# Altium project IRISkontroller.PrjPcb
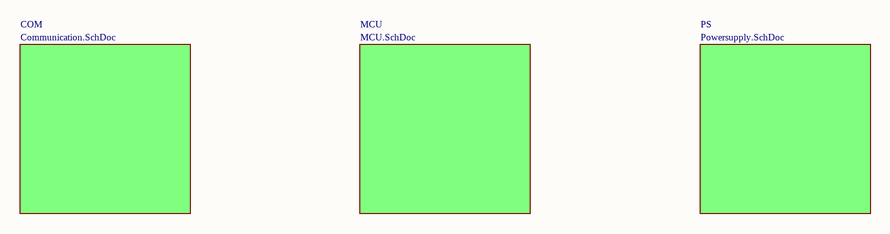
[diagram p0: Top.SchDoc]
4 sheets, 85 parts. Net scope: global (net labels, ports and power ports of the same name join across sheets).
Board file: IRISkontroller.PcbDoc
Sheets:
  Top.SchDoc
    MCU = MCU.SchDoc
    PS = Powersupply.SchDoc
    COM = Communication.SchDoc

## Sheet Top.SchDoc
size A3

### Sub-sheets
COM = Communication.SchDoc: no entries
MCU = MCU.SchDoc: no entries
PS = Powersupply.SchDoc: no entries

## Sheet MCU.SchDoc
size A3
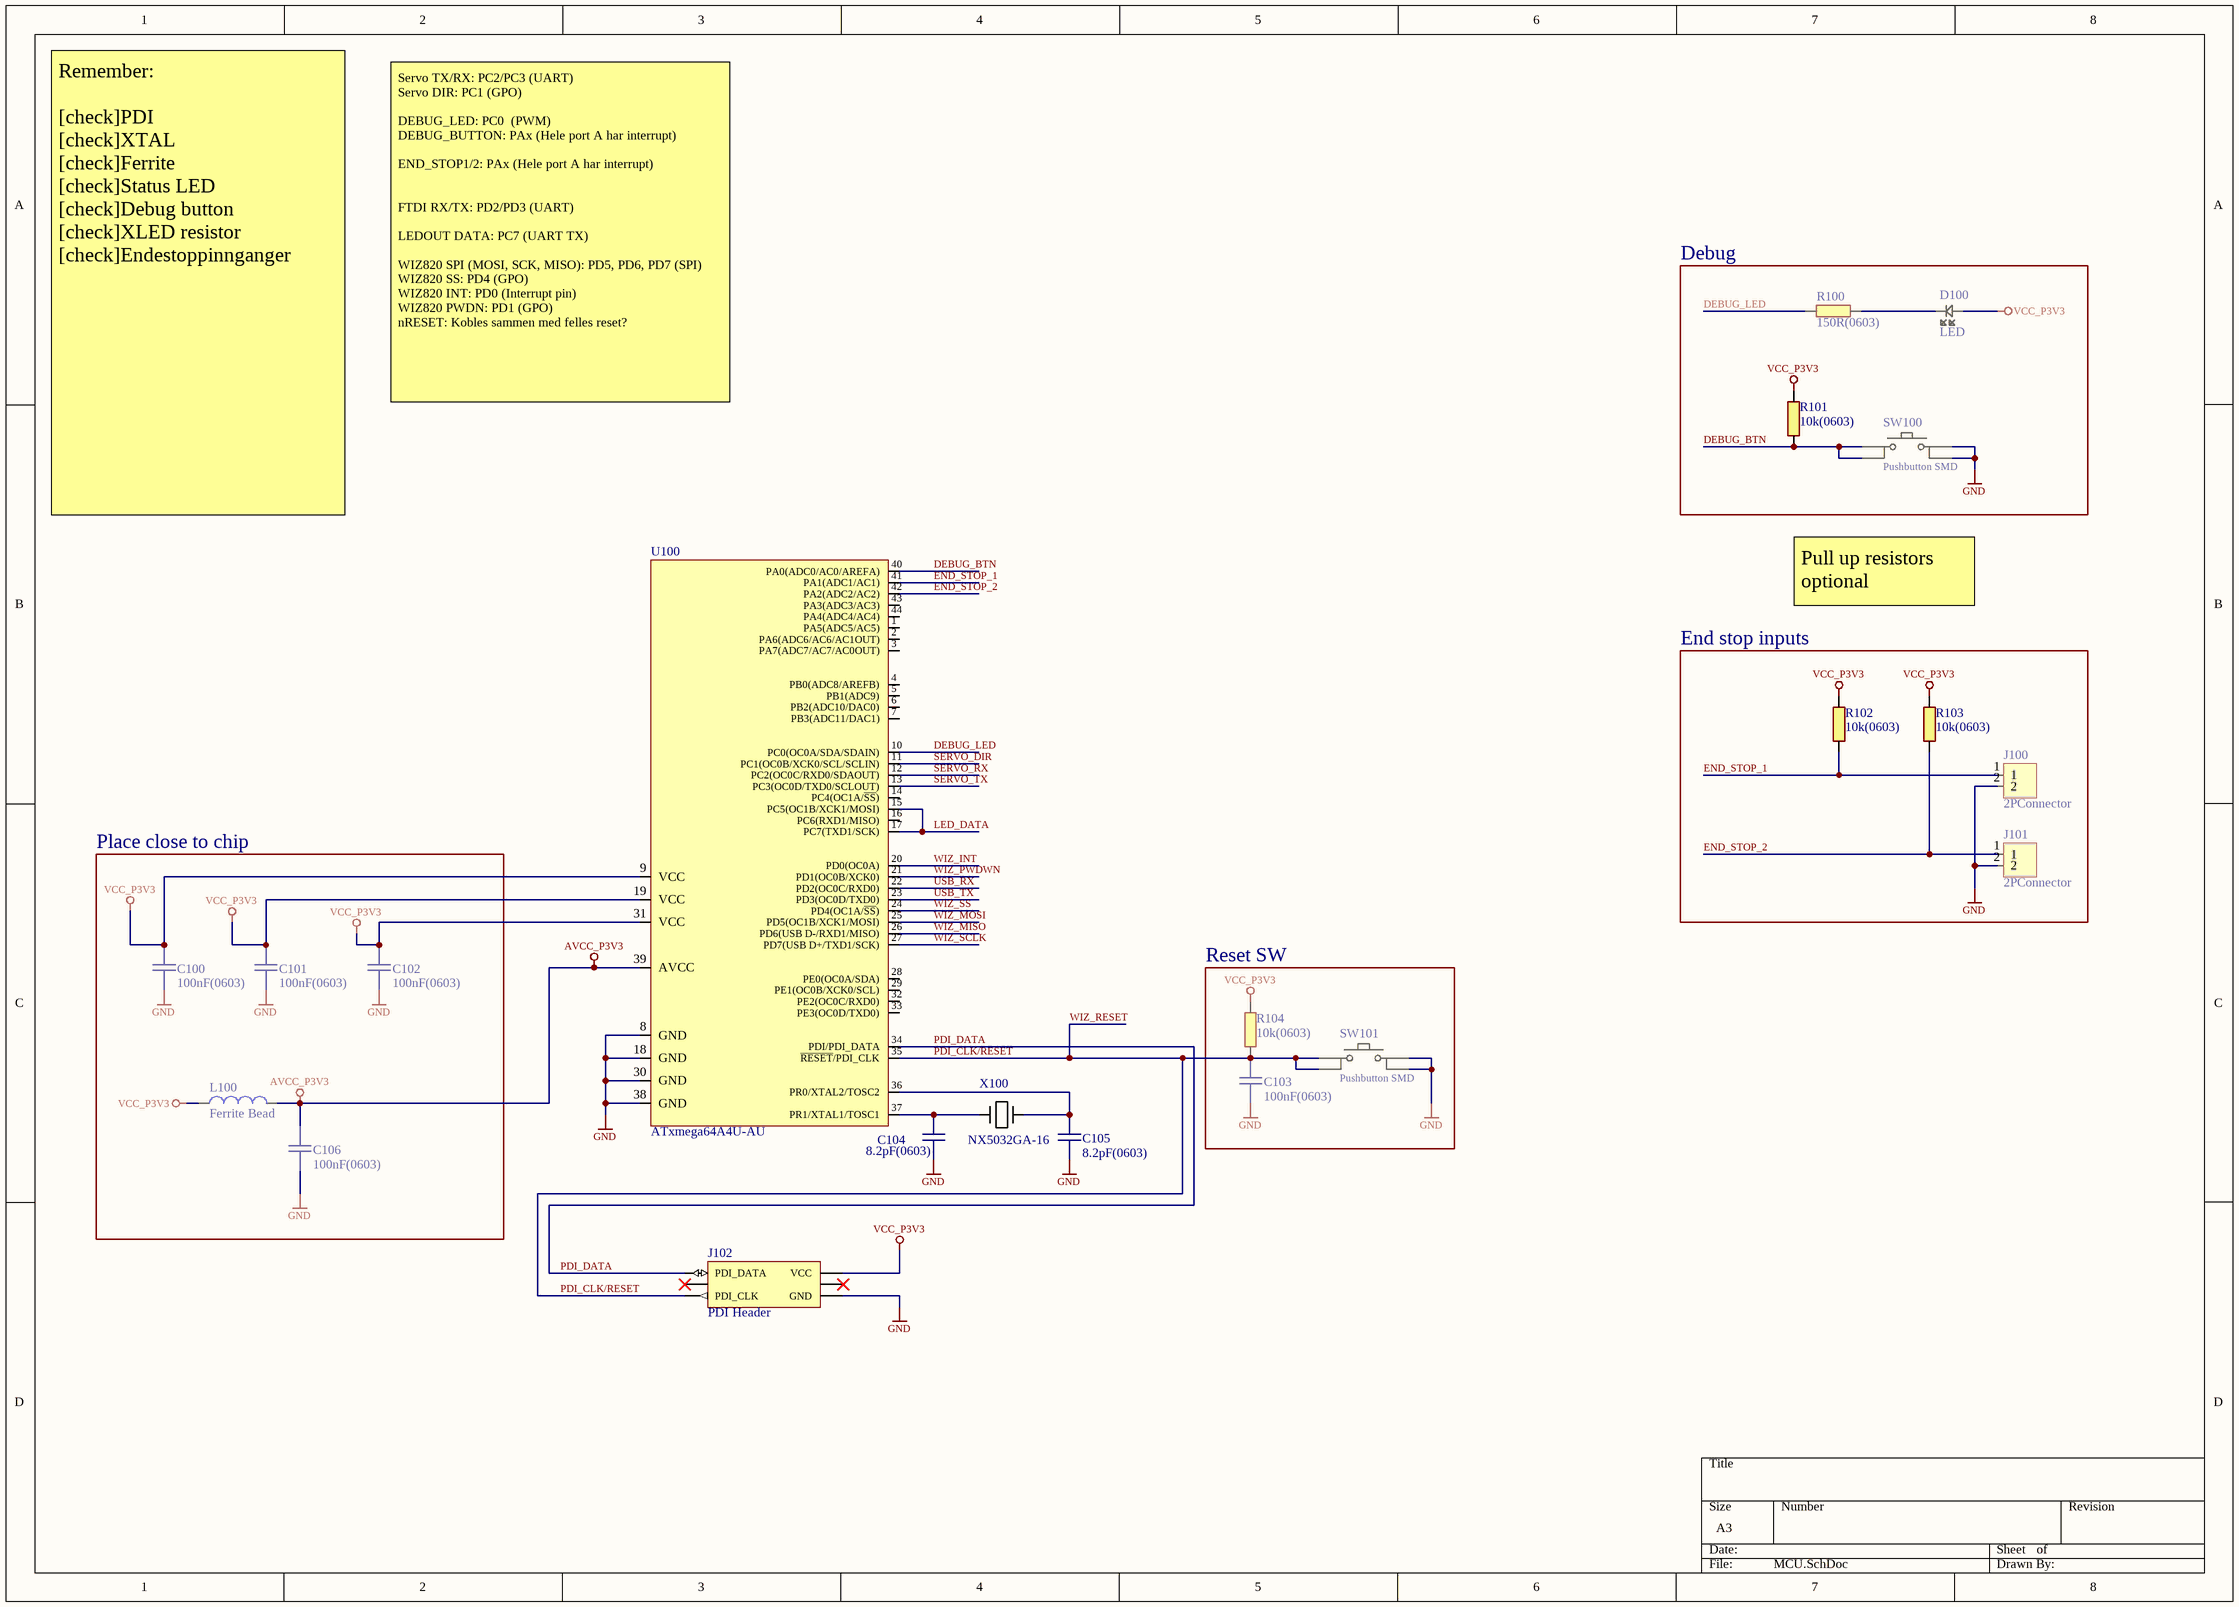
[diagram p1: MCU.SchDoc]

### Parts
C100  100nF(0603)  [CAPC0603(1608)55_N]
C101  100nF(0603)  [CAPC0603(1608)55_N]
C102  100nF(0603)  [CAPC0603(1608)55_N]
C103  100nF(0603)  [CAPC0603(1608)55_N]
C104  8.2pF(0603)  [CAPC0603(1608)55_N]
C105  8.2pF(0603)  [CAPC0603(1608)55_N]
C106  100nF(0603)  [CAPC0603(1608)55_N]
D100  LED  [I_LEDC0603(1608)_N]
J100  2PConnector  [JST_2P]
J101  2PConnector  [JST_2P]
J102  PDI Header  [HEADER_3x2]
L100  Ferrite Bead  [0603]
R100  150R(0603)  [RESC0603(1608)_N]
R101  10k(0603)  [RESC0603(1608)_N]
R102  10k(0603)  [RESC0603(1608)_N]
R103  10k(0603)  [RESC0603(1608)_N]
R104  10k(0603)  [RESC0603(1608)_N]
SW100  Pushbutton SMD  [SOIC254P500X160-4]
SW101  Pushbutton SMD  [SOIC254P500X160-4]
U100  ATxmega64A4U-AU  [44A_N]
X100  NX5032GA-16  [CRYSTAL-ABM7]

### Blocks framed on the sheet
Debug: D100 R100 R101 SW100
End stop inputs: J100 J101 R102 R103
Place close to chip: C100-C102 C106 L100
Reset SW: C103 R104 SW101

### Nets
AVCC_P3V3: C106.2 L100.2 U100.39(AVCC)
GND: C100.2 C101.2 C102.2 C103.1 C104.1 C105.1 C106.1 J100.2 J101.2 J102.6(GND) SW100.3 SW100.4 SW101.3 SW101.4 U100.8(GND) U100.18(GND) U100.30(GND) U100.38(GND)
VCC_P3V3: C100.1 C101.1 C102.1 D100.1 J102.2(VCC) L100.1 R101.2 R102.2 R103.2 R104.2 U100.9(VCC) U100.19(VCC) U100.31(VCC)
DEBUG_BTN: R101.1 SW100.1 SW100.2 U100.40(PA0(ADC0/AC0/AREFA))
DEBUG_LED: R100.1 U100.10(PC0(OC0A/SDA/SDAIN))
END_STOP_1: J100.1 R102.1 U100.41(PA1(ADC1/AC1))
END_STOP_2: J101.1 R103.1 U100.42(PA2(ADC2/AC2))
LED_DATA: U100.15(PC5(OC1B/XCK1/MOSI)) U100.17(PC7(TXD1/SCK))
PDI_CLK/RESET: C103.2 J102.5(PDI_CLK) R104.1 SW101.1 SW101.2 U100.35(~{RESET}/PDI_CLK)  [also labelled WIZ_RESET]
PDI_DATA: J102.1(PDI_DATA) U100.34(PDI/PDI_DATA)
SERVO_DIR: U100.11(PC1(OC0B/XCK0/SCL/SCLIN))
SERVO_RX: U100.12(PC2(OC0C/RXD0/SDAOUT))
SERVO_TX: U100.13(PC3(OC0D/TXD0/SCLOUT))
USB_RX: U100.22(PD2(OC0C/RXD0))
USB_TX: U100.23(PD3(OC0D/TXD0))
WIZ_INT: U100.20(PD0(OC0A))
WIZ_MISO: U100.26(PD6(USB_D-/RXD1/MISO))
WIZ_MOSI: U100.25(PD5(OC1B/XCK1/MOSI))
WIZ_PWDWN: U100.21(PD1(OC0B/XCK0))
WIZ_SCLK: U100.27(PD7(USB_D+/TXD1/SCK))
WIZ_SS: U100.24(PD4(OC1A/~{SS}))
NetC104_2: C104.2 U100.37(PR1/XTAL1/TOSC1) X100.1
NetC105_2: C105.2 U100.36(PR0/XTAL2/TOSC2) X100.2
NetD100_2: D100.2 R100.2

Not connected (* = marked no-connect by the designer): J102 3* 4*; U100 1(PA5(ADC5/AC5)) 2(PA6(ADC6/AC6/AC1OUT)) 3(PA7(ADC7/AC7/AC0OUT)) 4(PB0(ADC8/AREFB)) 5(PB1(ADC9)) 6(PB2(ADC10/DAC0)) 7(PB3(ADC11/DAC1)) 14(PC4(OC1A/~{SS})) 16(PC6(RXD1/MISO)) 28(PE0(OC0A/SDA)) 29(PE1(OC0B/XCK0/SCL)) 32(PE2(OC0C/RXD0)) 33(PE3(OC0D/TXD0)) 43(PA3(ADC3/AC3)) 44(PA4(ADC4/AC4))

### Notes on the sheet
- Servo TX/RX: PC2/PC3 (UART)
  Servo DIR: PC1 (GPO)
  DEBUG_LED: PC0 	(PWM)
  DEBUG_BUTTON: PAx (Hele port A har interrupt)
  END_STOP1/2: PAx (Hele port A har interrupt)
  FTDI RX/TX: PD2/PD3 (UART)
  LEDOUT DATA: PC7 (UART TX)
  WIZ820 SPI (MOSI, SCK, MISO): PD5, PD6, PD7 (SPI)
  WIZ820 SS: PD4 (GPO)
  WIZ820 INT: PD0 (Interrupt pin)
  WIZ820 PWDN: PD1 (GPO)
  nRESET: Kobles sammen med felles reset?
- Remember:
  [check]PDI
  [check]XTAL
  [check]Ferrite
  [check]Status LED
  [check]Debug button
  [check]XLED resistor
  [check]Endestoppinnganger
- Pull up resistors optional

### Library data of the parts
C100-C103 C106 = 100nF(0603): 100nF 0603 5% X7R 50V; pakke_opprettet_av: 815; pris: 1; nokkelord: Kondensator, Capacitor, CAP; pakketype: 93; id: 3028; navn: 100nF(0603); pakke_opprettet: 18.02.2015 14:18:13; symbol_opprettet_av: 815; symbol_opprettet: 14.11.2014 20:19:34
C104 C105 = 8.2pF(0603): 0603 5% NP0 50V; pakke_opprettet_av: 815; pris: 1; nokkelord: Kondensator, Capacitor, CAP; pakketype: 93; id: 3032; navn: 8.2pF(0603); pakke_opprettet: 18.02.2015 14:18:13; symbol_opprettet_av: 815; symbol_opprettet: 14.11.2014 20:19:34
D100 = SMD LED Red: SMD; rad: 0; rom: OV; lager_type: Fremlager; dybde: 2; hylle: 13; antall: 50; pakke_opprettet_av: 815; leverandor_varenr: 8554641; pris: 1; pakketype: 93; produsent: Avago; leverandor: Farnell; id: 2209; navn: SMD LED Red; kolonne: 0; pakke_opprettet: 06.07.2014 18:55:44; symbol_opprettet_av: 815; symbol_opprettet: 06.07.2014 18:59:47; nokkelord: SMD
J100 J101 = JST 2pin: pris pr. stk.; pakke_opprettet_av: 815; pris: 2; nokkelord: Connector, Kontakt; pakketype: 92; id: 2227; navn: JST 2pin; pakke_opprettet: 28.06.2014 18:25:03; symbol_opprettet_av: 815; symbol_opprettet: 28.06.2014 15:33:17
J102 = PDI-HEADER: PDI Xmega programming header; pakke_opprettet_av: 774; leverandor_varenr: Derp; pris: 3; pakketype: 92; produsent: OV; leverandor: Farnell; id: 2407; navn: PDI-HEADER; pakke_opprettet: 23.08.2014 13:37:50; symbol_opprettet_av: 774; symbol_opprettet: 23.08.2014 13:38:30; nokkelord: PDI Xmega programming
L100 = BLM18SG331TN1D: Ferrite Bead 0603; Farnell: 1515756RL; MPN: BLM18SG331TN1D; Digi-Key: 490-3997-1-ND
R100 = 3031: 0603 0.1W 1% Thick film resistor; id: 3031; pakke_opprettet_av: 815; symbol_opprettet_av: oystesm; pris: 0; nokkelord: Motstand, Resistor; pakketype: 93; produsent: Multikomp; pakke_opprettet: 08.07.2014 21:15:30; symbol_opprettet: 08.07.2014 21:16:33; navn: 150R(0603)
R101-R104 = 2444: 10k 0603 0.1W 1% Thick film resistor; id: 2444; rad: -1; rom: OV; lager_type: Fremlager; dybde: 72; hylle: 6; antall: 100; kolonne: 0; pakke_opprettet_av: 815; symbol_opprettet_av: oystesm; nokkelord: Resistor Motstand; pakketype: 93; pakke_opprettet: 08.07.2014 21:15:30; symbol_opprettet: 08.07.2014 21:16:33; navn: 10k(0603); pris: 0
SW100 SW101 = Pushbutton SMD: Momentary tactile pushbutton SMD; rad: 3; rom: OV; lager_type: Fremlager; dybde: 2; hylle: 7; antall: 100; pakke_opprettet_av: 815; nokkelord: smd, tactile, pushbutton, knapp, smd; pakketype: 101; id: 2413; navn: Pushbutton SMD; kolonne: 3; pakke_opprettet: 14.11.2014 22:12:31; symbol_opprettet_av: 815; symbol_opprettet: 14.11.2014 21:57:30; pris: 2
U100 = ATxmega64A4U-AU: 8/16-bit AVR XMEGA A4U Microcontroller, 1.6-3.6V, 64KB + 4KB Flash; PackageReference: 44A; PackageDescription: 44-Pin Plastic Thin Profile Quad Flat Pack, 10 x 10 x 1.0 mm Body, 0.8 mm Pitch (TQFP)
X100 = NX5032GA-16: Crystal 16 MHz; rad: 0; rom: OV; lager_type: Fremlager; dybde: 1; hylle: 2; antall: 42; kolonne: 3; pakke_opprettet_av: 774; leverandor_varenr: 644-1135-1-ND; pris: 5; nokkelord: xtal, oscillator; pakketype: 101; produsent: NDK; leverandor: DigiKey; id: 1594; navn: NX5032GA-16; pakke_opprettet: 23.08.2014 20:10:40; symbol_opprettet_av: 774; symbol_opprettet: 23.08.2014 20:23:20

## Sheet Powersupply.SchDoc
size A3
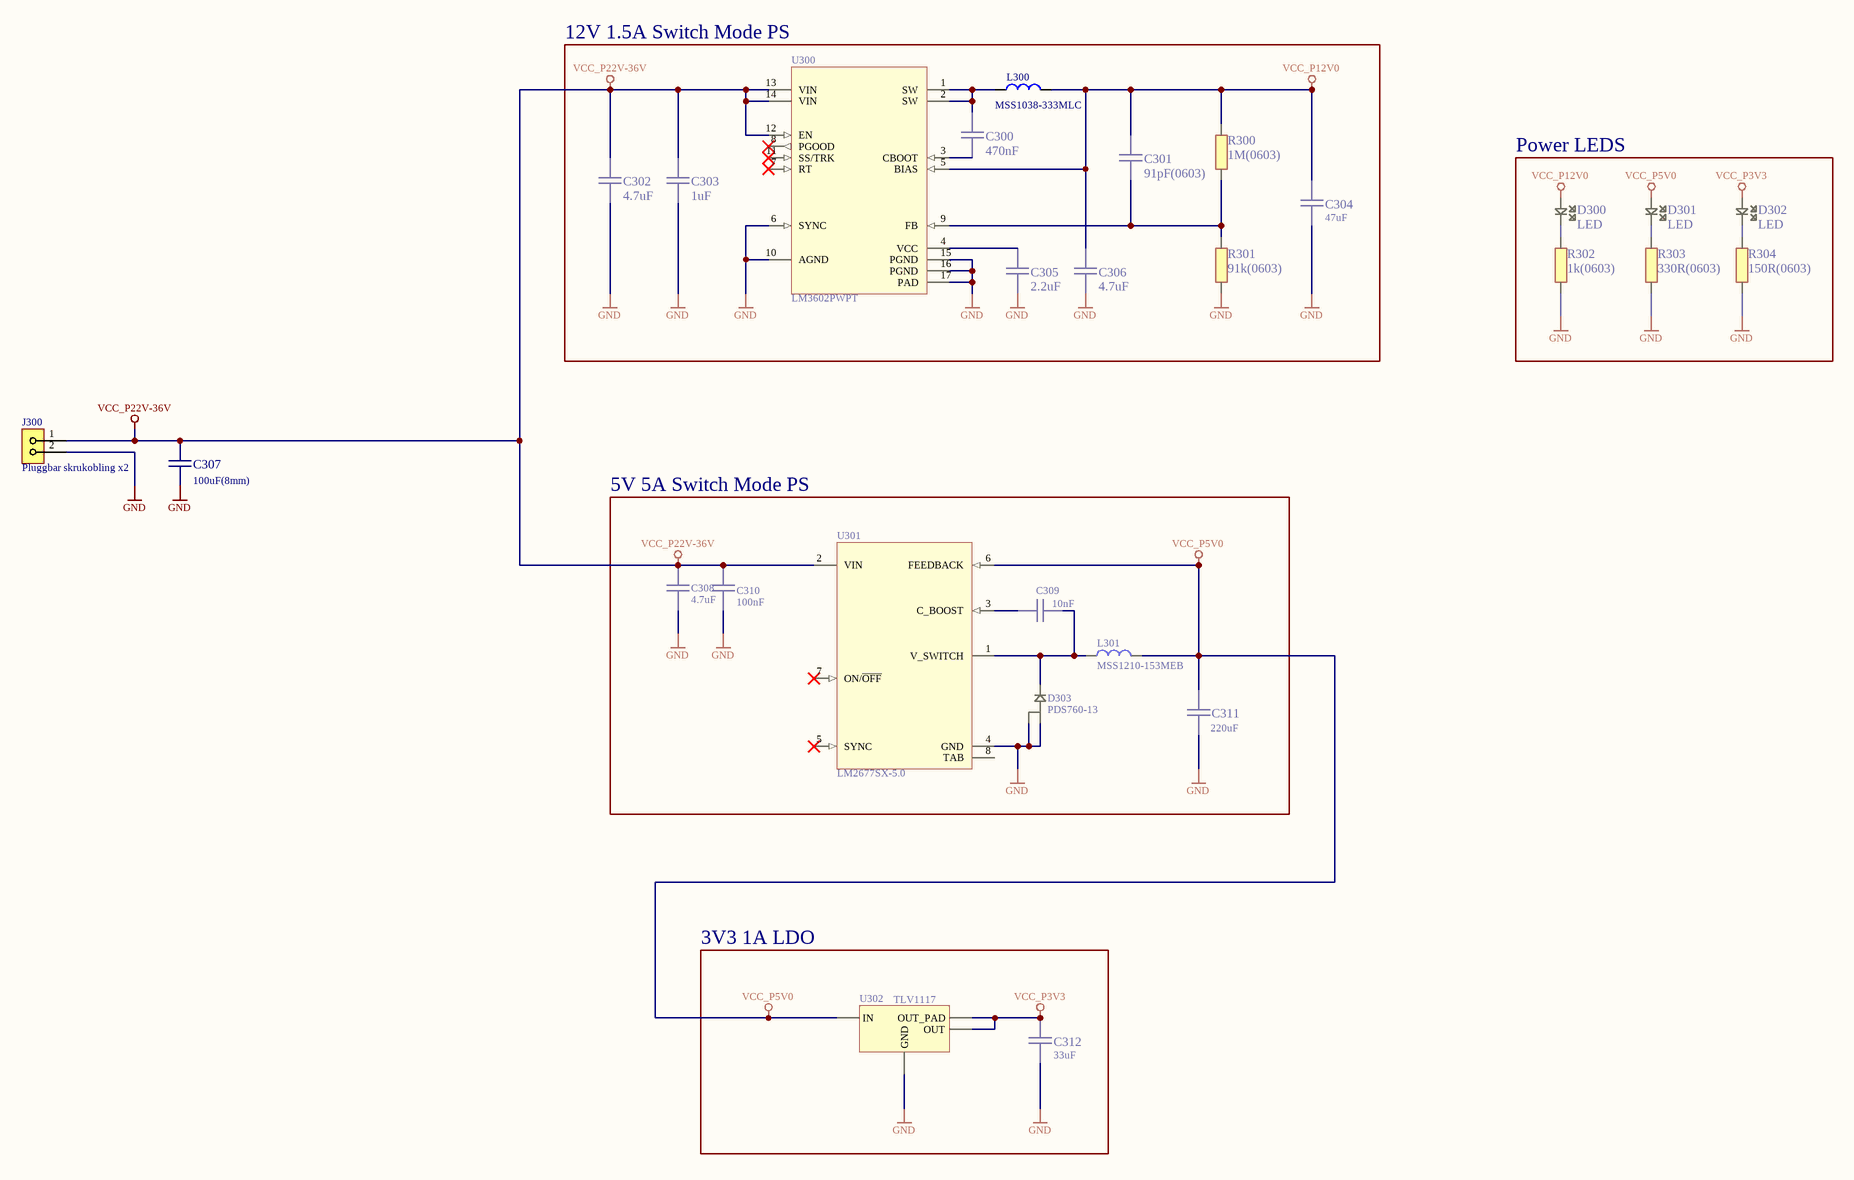
[diagram p2: Powersupply.SchDoc]

### Parts
C300  470nF  [CAPC0805(2012)100_N]
C301  91pF(0603)  [CAPC0603(1608)55_N]
C302  4.7uF  [CAPC1206(3216)170_N]
C303  1uF  [CAPC1206(3216)170_N]
C304  verdi: 47uF  [CAPMP7342X30N]  (hidden comment: T495D476M025ATE120)
C305  2.2uF  [CAPC0603(1608)55_N]
C306  4.7uF  [CAPC1206(3216)170_N]
C307  100uF(8mm)  [CAPPR35D08H11]
C308  4.7uF  [CAPC1206(3216)170_N]
C309  10nF  [CAPC0805(2012)100_N]
C310  100nF  [CAPC0805(2012)100_N]
C311  verdi: 220uF  [CAPMP7342X30N]  (hidden comment: 10TPB220ML)
C312  verdi: 33uF  [CAPMP7342X30N]  (hidden comment: 10TPB33M)
D300  LED  [I_LEDC0603(1608)_N]
D301  LED  [I_LEDC0603(1608)_N]
D302  LED  [I_LEDC0603(1608)_N]
D303  PDS760-13  [DFN540P650X115-3N]
J300  Pluggbar skrukobling x2  [FCI-20020110-C021A01LF]
L300  MSS1038-333MLC  [INDP102100X40N]
L301  MSS1210-153MEB  [INDP123123X100N]
R300  1M(0603)  [RESC0603(1608)_N]
R301  91k(0603)  [RESC0603(1608)_N]
R302  1k(0603)  [RESC0603(1608)_N]
R303  330R(0603)  [RESC0603(1608)_N]
R304  150R(0603)  [RESC0603(1608)_N]
U300  LM3602PWPT  [HTSSOP65P640X120_HS-17N]
U301  LM2677SX-5.0  [DPAK127P1336X457-8N]
U302  TLV1117  [SOT230P700X180-4N]

### Blocks framed on the sheet
12V 1.5A Switch Mode PS: C300-C306 L300 R300 R301 U300
Power LEDS: D300-D302 R302-R304
5V 5A Switch Mode PS: C308-C311 D303 L301 U301
3V3 1A LDO: C312 U302

### Nets
GND: C302.1 C303.1 C304.1 C305.1 C306.1 C307.1 C308.1 C310.1 C311.1 C312.1 D303.1(A) D303.2(A) J300.2 R301.1 R302.1 R303.1 R304.1 U300.6(SYNC) U300.10(AGND) U300.15(PGND) U300.16(PGND) U300.17(PAD) U301.4(GND) U302.1(GND)
VCC_P3V3: C312.2 D302.1 U302.2(OUT_PAD) U302.4(OUT)
VCC_P5V0: C311.2 D301.1 L301.2 U301.6(FEEDBACK) U302.3(IN)
VCC_P12V0: C301.2 C304.2 C306.2 D300.1 L300.2 R300.2 U300.5(BIAS)
VCC_P22V-36V: C302.2 C303.2 C307.2 C308.2 C310.2 J300.1 U300.12(EN) U300.13(VIN) U300.14(VIN) U301.2(VIN)
NetC300_1: C300.1 U300.3(CBOOT)
NetC300_2: C300.2 L300.1 U300.1(SW) U300.2(SW)
NetC301_1: C301.1 R300.1 R301.2 U300.9(FB)
NetC305_2: C305.2 U300.4(VCC)
NetC309_1: C309.1 U301.3(C_BOOST)
NetC309_2: C309.2 D303.3(K) L301.1 U301.1(V_SWITCH)
NetD300_2: D300.2 R302.2
NetD301_2: D301.2 R303.2
NetD302_2: D302.2 R304.2

Not connected (* = marked no-connect by the designer): U300 7(RT)* 8(PGOOD)* 11(SS/TRK)*; U301 5(SYNC)* 7(ON/~{OFF})* 8(TAB)

### Library data of the parts
C300 = 470nF: 470nF 0805 chip X7R 50V; pakke_opprettet_av: 815; leverandor_varenr: 2320847; pris: 1; nokkelord: Kondensator, capacitor; pakketype: 94; produsent: Multikomp; leverandor: Farnell; navn: 470nF; pakke_opprettet: 14.11.2014 20:52:01; symbol_opprettet_av: 815; symbol_opprettet: 14.11.2014 20:19:34
C301 = 91pF(0603): 100nF 0603 5% NP0 50V; pakke_opprettet_av: 815; leverandor_varenr: 1865484; pris: 1; nokkelord: Kondensator, Capacitor, CAP; pakketype: 93; produsent: Kemet; leverandor: Farnell; id: 3026; navn: 91pF(0603); pakke_opprettet: 18.02.2015 14:18:13; symbol_opprettet_av: 815; symbol_opprettet: 14.11.2014 20:19:34
C302 C306 C308 = 4.7uF: 100nF 1206 chip X7R 50V; pakke_opprettet_av: 815; pris: 1; nokkelord: Kondensator, capacitor; pakketype: 95; produsent: Multikomp; navn: 4.7uF; pakke_opprettet: 11.02.2015 13:21:22; symbol_opprettet_av: 815; symbol_opprettet: 14.11.2014 20:19:34
C303 = 1uF: 1uF 1206 chip X7R 50V; pakke_opprettet_av: 815; leverandor_varenr: 1759454; pris: 2; nokkelord: Kondensator, capacitor; pakketype: 95; produsent: Multikomp; leverandor: Farnell; navn: 1uF; pakke_opprettet: 11.02.2015 13:21:22; symbol_opprettet_av: 815; symbol_opprettet: 14.11.2014 20:19:34
C304 = T495D476M025ATE120: Manufacturer: Kemet; Farnell: 2395821; MPN: T495D476M025ATE120
C305 = 2.2uF: 2.2uF 0603 chip X7R 6.3V; pakke_opprettet_av: 815; leverandor_varenr: 2320810; pris: 1; nokkelord: Kondensator, capacitor; pakketype: 93; produsent: Multikomp; leverandor: Farnell; navn: 2.2uF; pakke_opprettet: 18.02.2015 14:18:13; symbol_opprettet_av: 815; symbol_opprettet: 14.11.2014 20:19:34
C307 = 100uF(8mm): D=8mm Radial, 20% 50V 3,5mm pitch; pakke_opprettet_av: 815; leverandor_varenr: 1902932; pris: 2; nokkelord: Kondensator, Capacitor, CAP; pakketype: 92; produsent: Multikomp; leverandor: Farnell; id: 3027; navn: 100uF(8mm); pakke_opprettet: 25.02.2015 11:22:52; symbol_opprettet_av: 815; symbol_opprettet: 14.11.2014 20:19:34
C309 = 10nF: 100nF 0805 chip X7R 50V; pakke_opprettet_av: 815; pris: 1; nokkelord: Kondensator, capacitor; pakketype: 94; produsent: Multikomp; navn: 10nF; pakke_opprettet: 14.11.2014 20:52:01; symbol_opprettet_av: 815; symbol_opprettet: 14.11.2014 20:19:34
C310 = 100nF: 100nF 0805 chip X7R 50V; pakke_opprettet_av: 815; leverandor_varenr: 2408556; pris: 1; nokkelord: Kondensator, capacitor; pakketype: 94; produsent: Multikomp; leverandor: Farnell; navn: 100nF; pakke_opprettet: 14.11.2014 20:52:01; symbol_opprettet_av: 815; symbol_opprettet: 14.11.2014 20:19:34
C311 = 10TPB220ML: Varenummer: 2354821; Leverandør: Farnell
C312 = 10TPB33M: Varenummer: 2354816; Leverandør: Farnell
D300-D302 = SMD LED Red: as D100 on sheet MCU; navn: SMD LED Red; kolonne: 0; pakke_opprettet: 06.07.2014 18:55:44; symbol_opprettet_av: 815; symbol_opprettet: 06.07.2014 18:59:47; nokkelord: SMD
D303 = PDS760-13: SCHOTTKY RECTIFIER POWERDI5; Leverandør: Farnell; Varenummer: 1713915
J300 = Pluggbar skrukobling x2: Skruplint; pakke_opprettet_av: 815; leverandor_varenr: 1787816; pris: 3; pakketype: 92; produsent: FCI; leverandor: Farnell; id: 2218; navn: Pluggbar skrukobling x2; pakke_opprettet: 13.11.2014 14:07:06; symbol_opprettet_av: 815; symbol_opprettet: 13.11.2014 10:58:53
L300 = MSS1038-333MLC: INDUCTOR, PWR, 33UH, 2.3A, 20%,13MHZ; Farnell: 2288211; MPN: MSS1038-333MLC
L301 = MSS1210-153MEB: INDUCTOR, PWR, 15UH, 8.7A, 20%,12MHZ; Farnell: 2288331
R300 = 3025: 0603 0.1W 1% Thick film resistor; id: 3025; rad: -1; rom: OV; lager_type: Fremlager; dybde: 119; hylle: 6; antall: 100; kolonne: 0; pakke_opprettet_av: 815; symbol_opprettet_av: oystesm; nokkelord: Resistor Motstand; pakketype: 93; pakke_opprettet: 08.07.2014 21:15:30; symbol_opprettet: 08.07.2014 21:16:33; navn: 1M(0603); pris: 0
R301 = 2997: 91k 0603 0.1W 1% Thick film resistor; id: 2997; rad: -1; rom: OV; lager_type: Fremlager; dybde: 95; hylle: 6; antall: 100; kolonne: 0; pakke_opprettet_av: 815; symbol_opprettet_av: oystesm; leverandor_varenr: 9331620; pakketype: 93; produsent: Multikomp; leverandor: Farnell; pakke_opprettet: 08.07.2014 21:15:30; symbol_opprettet: 08.07.2014 21:16:33; navn: 91k(0603); pris: 0; nokkelord: Resistor
R302 = 3029: 0603 0.1W 1% Thick film resistor; id: 3029; pakke_opprettet_av: 815; symbol_opprettet_av: oystesm; pris: 0; nokkelord: Resistor Motstand; pakketype: 93; produsent: Multikomp; pakke_opprettet: 08.07.2014 21:15:30; symbol_opprettet: 08.07.2014 21:16:33; navn: 1k(0603)
R303 = 2448: 330R 0603 0.1W 1% Thick film resistor; id: 2448; rad: -1; rom: OV; lager_type: Fremlager; dybde: 42; hylle: 6; antall: 100; kolonne: 0; pakke_opprettet_av: 815; symbol_opprettet_av: oystesm; nokkelord: Resistor Motstand; pakketype: 93; pakke_opprettet: 08.07.2014 21:15:30; symbol_opprettet: 08.07.2014 21:16:33; navn: 330R(0603); pris: 0
R304 = 3031: as R100 on sheet MCU; pakke_opprettet: 08.07.2014 21:15:30; symbol_opprettet: 08.07.2014 21:16:33; navn: 150R(0603)
U300 = LM3602PWPT: MPN: LM43602PWPT; Manufacturer: Texas Instruments; Farnell: 2425776
U301 = LM2677SX-5.0: Leverandør: DigiKey; Varenummer: LM2677S-5.0/NOPB-ND
U302 = TLV1117: Low dropout regulator; pakke_opprettet_av: 774; leverandor_varenr: 1494942; pris: 5; nokkelord: ldo; pakketype: 77; produsent: Texas Instruments; leverandor: Farnell; navn: TLV1117; pakke_opprettet: 11.07.2014 22:00:23; symbol_opprettet_av: 774; symbol_opprettet: 11.07.2014 22:01:42

## Sheet Communication.SchDoc
size A3
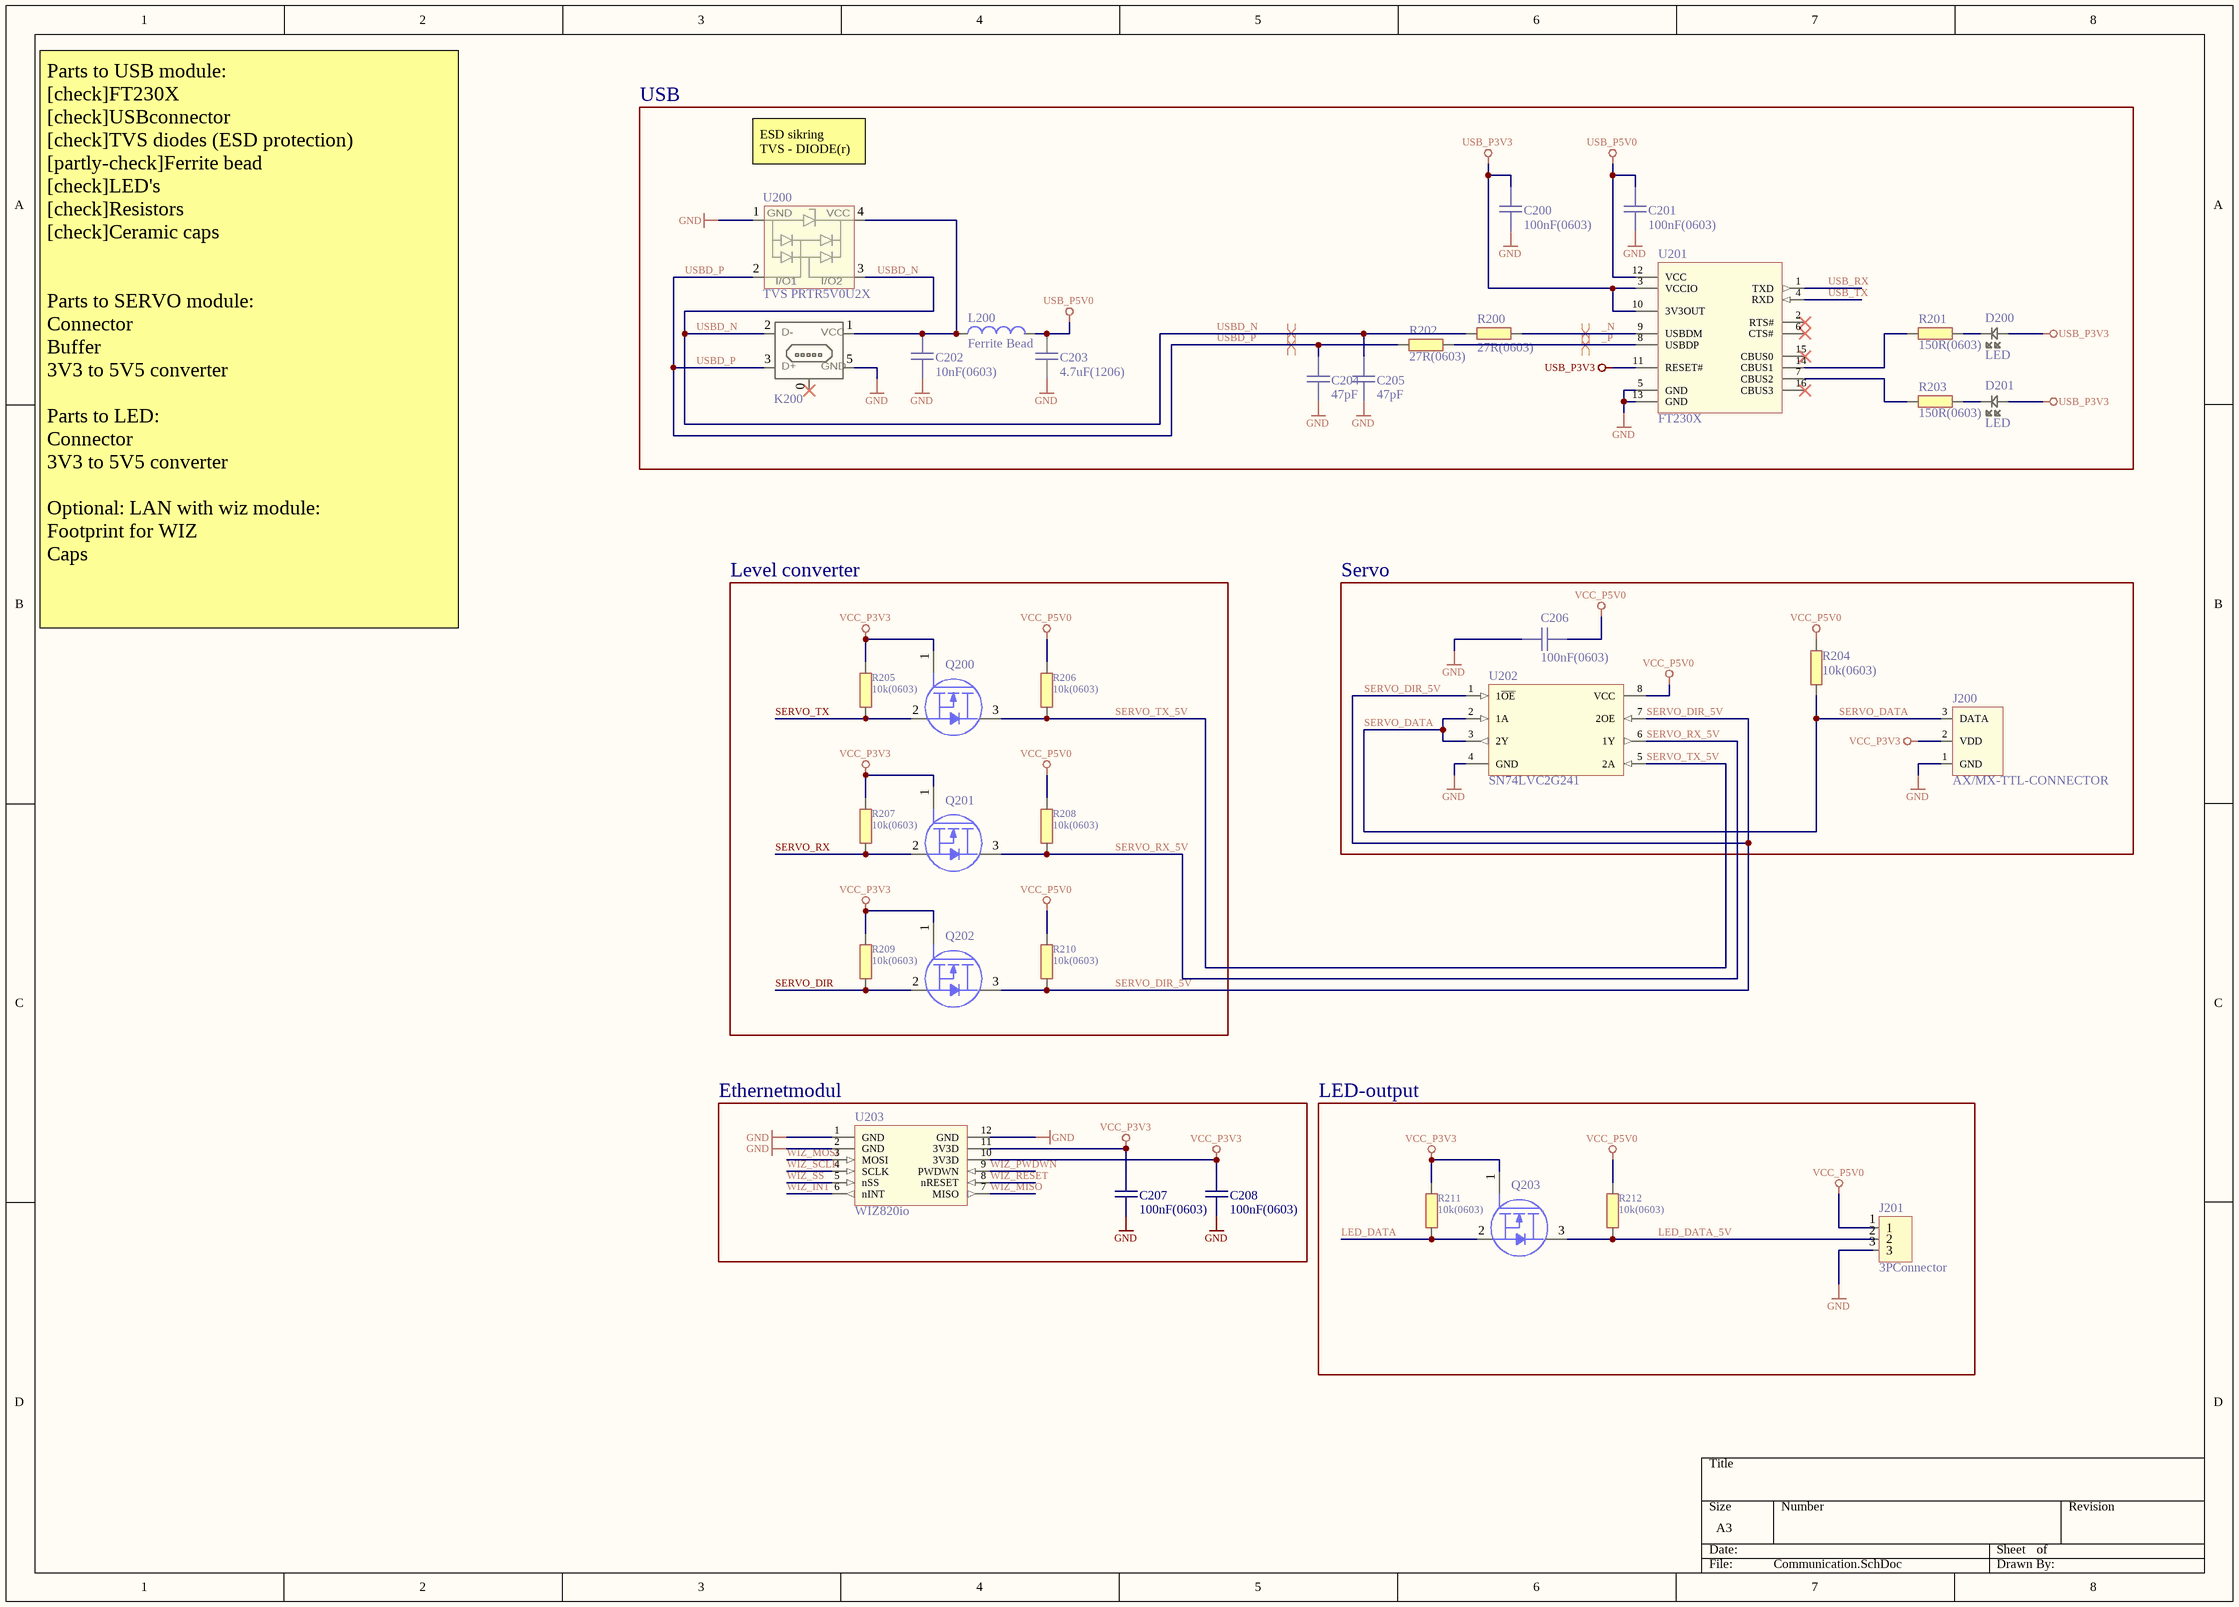
[diagram p3: Communication.SchDoc]

### Parts
C200  100nF(0603)  [CAPC0603(1608)55_N]
C201  100nF(0603)  [CAPC0603(1608)55_N]
C202  10nF(0603)  [CAPC0603(1608)55_N]
C203  4.7uF(1206)  [CAPC1206(3216)170_N]
C204  47pF  [CAPC0603(1608)55_N]
C205  47pF  [CAPC0603(1608)55_N]
C206  100nF(0603)  [CAPC0603(1608)55_N]
C207  100nF(0603)  [CAPC0603(1608)55_N]
C208  100nF(0603)  [CAPC0603(1608)55_N]
D200  LED  [I_LEDC0603(1608)_N]
D201  LED  [I_LEDC0603(1608)_N]
J200  AX/MX-TTL-CONNECTOR  [MOLEX_22-03-5035]
J201  3PConnector  [JST_3P]
K200  USB-OTG  [MILL-MAX_897-43-005-00-100001]  (value not drawn)
L200  Ferrite Bead  [0603]
Q200  MOSFET_N_GSD  [SOT323P130X100-3_N]  (value not drawn)
Q201  MOSFET_N_GSD  [SOT323P130X100-3_N]  (value not drawn)
Q202  MOSFET_N_GSD  [SOT323P130X100-3_N]  (value not drawn)
Q203  MOSFET_N_GSD  [SOT323P130X100-3_N]  (value not drawn)
R200  27R(0603)  [RESC0603(1608)_N]
R201  150R(0603)  [RESC0603(1608)_N]
R202  27R(0603)  [RESC0603(1608)_N]
R203  150R(0603)  [RESC0603(1608)_N]
R204  10k(0603)  [RESC0603(1608)_N]
R205  10k(0603)  [RESC0603(1608)_N]
R206  10k(0603)  [RESC0603(1608)_N]
R207  10k(0603)  [RESC0603(1608)_N]
R208  10k(0603)  [RESC0603(1608)_N]
R209  10k(0603)  [RESC0603(1608)_N]
R210  10k(0603)  [RESC0603(1608)_N]
R211  10k(0603)  [RESC0603(1608)_N]
R212  10k(0603)  [RESC0603(1608)_N]
U200  TVS PRTR5V0U2X  [SOT143B-M]
U201  FT230X  [SOP0635P4800-16N]
U202  SN74LVC2G241  [TSOP65P400X130-8N]
U203  WIZ820io  [Wiz820io]

### Blocks framed on the sheet
USB: C200-C205 D200 D201 K200 L200 R200-R203 U200 U201
Level converter: Q200-Q202 R205-R210
Servo: C206 J200 R204 U202
Ethernetmodul: C207 C208 U203
LED-output: J201 Q203 R211 R212

### Nets
GND: C200.1 C201.1 C202.1 C203.1 C204.1 C205.1 C206.1 C207.1 C208.1 J200.1(GND) J201.3 K200.5(GD) U200.1(GND) U201.5(GND) U201.13(GND) U202.4(GND) U203.1(GND) U203.2(GND) U203.12(GND)
USB_P3V3: C200.2 D200.1 D201.1 U201.3(VCCIO) U201.10(3V3OUT) U201.11(RESET#)
USB_P5V0: C201.2 C203.2 L200.2 U201.12(VCC)
VCC_P3V3: C207.2 C208.2 J200.2(VDD) Q200.1(Gate) Q201.1(Gate) Q202.1(Gate) Q203.1(Gate) R205.1 R207.1 R209.1 R211.1 U203.10(3V3D) U203.11(3V3D)
VCC_P5V0: C206.2 J201.1 R204.2 R206.1 R208.1 R210.1 R212.1 U202.8(VCC)
_N: R200.2 U201.9(USBDM)
_P: R202.2 U201.8(USBDP)
LED_DATA: Q203.2(Source) R211.2
LED_DATA_5V: J201.2 Q203.3(Drain) R212.2
SERVO_DATA: J200.3(DATA) R204.1 U202.2(1A) U202.3(2Y)
SERVO_DIR: Q202.2(Source) R209.2
SERVO_DIR_5V: Q202.3(Drain) R210.2 U202.1(1~{OE}) U202.7(2OE)
SERVO_RX: Q201.2(Source) R207.2
SERVO_RX_5V: Q201.3(Drain) R208.2 U202.6(1Y)
SERVO_TX: Q200.2(Source) R205.2
SERVO_TX_5V: Q200.3(Drain) R206.2 U202.5(2A)
USB_RX: U201.1(TXD)
USB_TX: U201.4(RXD)
USBD_N: C205.2 K200.2(D-) R200.1 U200.3(I/O2)
USBD_P: C204.2 K200.3(D+) R202.1 U200.2(I/O1)
WIZ_INT: U203.6(nINT)
WIZ_MISO: U203.7(MISO)
WIZ_MOSI: U203.3(MOSI)
WIZ_PWDWN: U203.9(PWDWN)
WIZ_RESET: U203.8(nRESET)  [project net PDI_CLK/RESET]
WIZ_SCLK: U203.4(SCLK)
WIZ_SS: U203.5(nSS)
NetC202_2: C202.2 K200.1(VB) L200.1 U200.4(VCC)
NetD200_2: D200.2 R201.1
NetD201_2: D201.2 R203.1
NetR201_2: R201.2 U201.14(CBUS1)
NetR203_2: R203.2 U201.7(CBUS2)

Not connected (* = marked no-connect by the designer): K200 0(Shield)*; U201 2(RTS#)* 6(CTS#)* 15(CBUS0)* 16(CBUS3)*

### Layout directives
differential pair: _N, _P, USBD_N, USBD_P

### Notes on the sheet
- (near U200) ESD sikring
  TVS - DIODE(r)
- Parts to USB module:
  [check]FT230X
  [check]USBconnector
  [check]TVS diodes (ESD protection)
  [partly-check]Ferrite bead
  [check]LED's
  [check]Resistors
  [check]Ceramic caps
  Parts to SERVO module:
  Connector
  Buffer
  3V3 to 5V5 converter
  Parts to LED:
  Connector
  3V3 to 5V5 converter
  Optional: LAN with wiz module:
  Footprint for WIZ
  Caps
- (in symbol MILL-MAX_897-43-005-00-100001) VCC; GND

### Library data of the parts
C200 C201 C206-C208 = 100nF(0603): as C100 on sheet MCU; navn: 100nF(0603); pakke_opprettet: 18.02.2015 14:18:13; symbol_opprettet_av: 815; symbol_opprettet: 14.11.2014 20:19:34
C202 = 10nF(0603): 0603 5% NP0 50V; pakke_opprettet_av: 815; pris: 1; nokkelord: Capacitor Cap Kondis; pakketype: 93; id: 3035; navn: 10nF(0603); pakke_opprettet: 18.02.2015 14:18:13; symbol_opprettet_av: 815; symbol_opprettet: 14.11.2014 20:19:34
C203 = 4.7uF(1206): 1206 chip X7R 50V; pakke_opprettet_av: 815; pris: 1; nokkelord: Kondensator, capacitor; pakketype: 95; produsent: Multikomp; id: 2992; navn: 4.7uF(1206); pakke_opprettet: 11.02.2015 13:21:22; symbol_opprettet_av: 815; symbol_opprettet: 14.11.2014 20:19:34
C204 C205 = 47pF: 0603 5% NP0 50V; pakke_opprettet_av: 815; pris: 1; nokkelord: Capacitor Cap Kondis; pakketype: 93; id: 3034; navn: 47pF; pakke_opprettet: 18.02.2015 14:18:13; symbol_opprettet_av: 815; symbol_opprettet: 14.11.2014 20:19:34
D200 D201 = SMD LED Red: as D100 on sheet MCU; navn: SMD LED Red; kolonne: 0; pakke_opprettet: 06.07.2014 18:55:44; symbol_opprettet_av: 815; symbol_opprettet: 06.07.2014 18:59:47; nokkelord: SMD
J200 = AX/MX-TTL-CONNECTOR: Dynamixel AX/MX-Series servo connector 3 pin TTL version; Manufaturer: MOLEX; MPN: 22-03-5035; Pinout: http://support.robotis.com/en/product/dynamixel/dxl_connector.htm; Farnell: 9979620
J201 = JST 3pin: pris pr. stk.; pakke_opprettet_av: 815; pris: 2; nokkelord: Connector, Kontakt; pakketype: 92; id: 2226; navn: JST 3pin; pakke_opprettet: 28.06.2014 18:25:12; symbol_opprettet_av: 815; symbol_opprettet: 28.06.2014 15:33:24
K200 = MILL-MAX_897-43-005-00-100001: MINI USB B DEVICE CONNECTOR MOLEX 51387-0571; Manufacturer: Mill-Max Manufacturing Corp.; Digi-Key: ED90341CT-ND; MPN: 897-43-005-00-100001; Farnell: 1925220
L200 = BLM18SG331TN1D: Ferrite Bead 0603; Farnell: 1515756RL; MPN: BLM18SG331TN1D; Digi-Key: 490-3997-1-ND
Q200-Q203 = 2N7002: N-Channel MOSFET 300mA; navn: 2N7002; leverandor: Farnell; pakke_opprettet_av: 815; symbol_opprettet_av: 774; leverandor_varenr: 1829184; pris: 2; pakketype: 101; pakke_opprettet: 13.11.2014 18:21:11; symbol_opprettet: 11.07.2014 23:17:04
R200 R202 = 3033: 0603 0.1W 1% Thick film resistor; id: 3033; pakke_opprettet_av: 815; symbol_opprettet_av: oystesm; pris: 0; nokkelord: Motstand, Resistor; pakketype: 93; pakke_opprettet: 08.07.2014 21:15:30; symbol_opprettet: 08.07.2014 21:16:33; navn: 27R(0603)
R201 R203 = 3031: as R100 on sheet MCU; pakke_opprettet: 08.07.2014 21:15:30; symbol_opprettet: 08.07.2014 21:16:33; navn: 150R(0603)
R204 = 2444: as R101 on sheet MCU; pakke_opprettet: 08.07.2014 21:15:30; symbol_opprettet: 08.07.2014 21:16:33; navn: 10k(0603); pris: 0
R205-R212 = 2444: 10k 0603 0.1W 1% Thick film resistor; rad: -1; rom: OV; lager_type: Fremlager; dybde: 72; hylle: 6; antall: 100; kolonne: 0; pakke_opprettet_av: 815; symbol_opprettet_av: oystesm; nokkelord: Resistor Motstand; pakketype: 93; id: 2444; navn: 10k(0603); pakke_opprettet: 08.07.2014 21:15:30; symbol_opprettet: 08.07.2014 21:16:33; pris: 0
U200 = PRTR5V0U2X: TVS Didode dual PRTR5V0U2X; Manufacturer: NXP; MPN: PRTR5V0U2X; Farnell Pn: 1524157; Digi-Key: 568-4140-1-ND
U201 = FT230X: IC USB SERIAL BASIC UART 16SSOP; MPN: FT230XS-R; Manufacturer: FTDI, Future Technology Devices International Ltd; Digi-Key: 768-1135-1-ND; Farnell: 2081321
U202 = SN74LVC2G241: Dual  Buffer/Driver  With  3-State  Outputs, designed for 1.65-5.5Vcc operation; Manufacturer: Texas Instruments; MPN: SN74LVC2G241DCUR; Farnell: 2437234
U203 = WIZ820io: WIZ820io, Ethernet module with W5200 module onboard and MAG-JACK; Manufacturer: WIZnet; MPN: WIZ820IO; Digi-Key: 1278-1015-ND

## Nets that join several sheets
GND: MCU (18 pins), Powersupply (24 pins), Communication (19 pins)
VCC_P3V3: MCU (13 pins), Powersupply (C312.2 D302.1 U302.2 U302.4), Communication (13 pins)
VCC_P5V0: Powersupply (5 pins), Communication (8 pins)
LED_DATA: MCU (U100.15 U100.17), Communication (Q203.2 R211.2)
PDI_CLK/RESET: MCU (6 pins), Communication (U203.8)
SERVO_DIR: MCU (U100.11), Communication (Q202.2 R209.2)
SERVO_RX: MCU (U100.12), Communication (Q201.2 R207.2)
SERVO_TX: MCU (U100.13), Communication (Q200.2 R205.2)
USB_RX: MCU (U100.22), Communication (U201.1)
USB_TX: MCU (U100.23), Communication (U201.4)
WIZ_INT: MCU (U100.20), Communication (U203.6)
WIZ_MISO: MCU (U100.26), Communication (U203.7)
WIZ_MOSI: MCU (U100.25), Communication (U203.3)
WIZ_PWDWN: MCU (U100.21), Communication (U203.9)
WIZ_SCLK: MCU (U100.27), Communication (U203.4)
WIZ_SS: MCU (U100.24), Communication (U203.5)